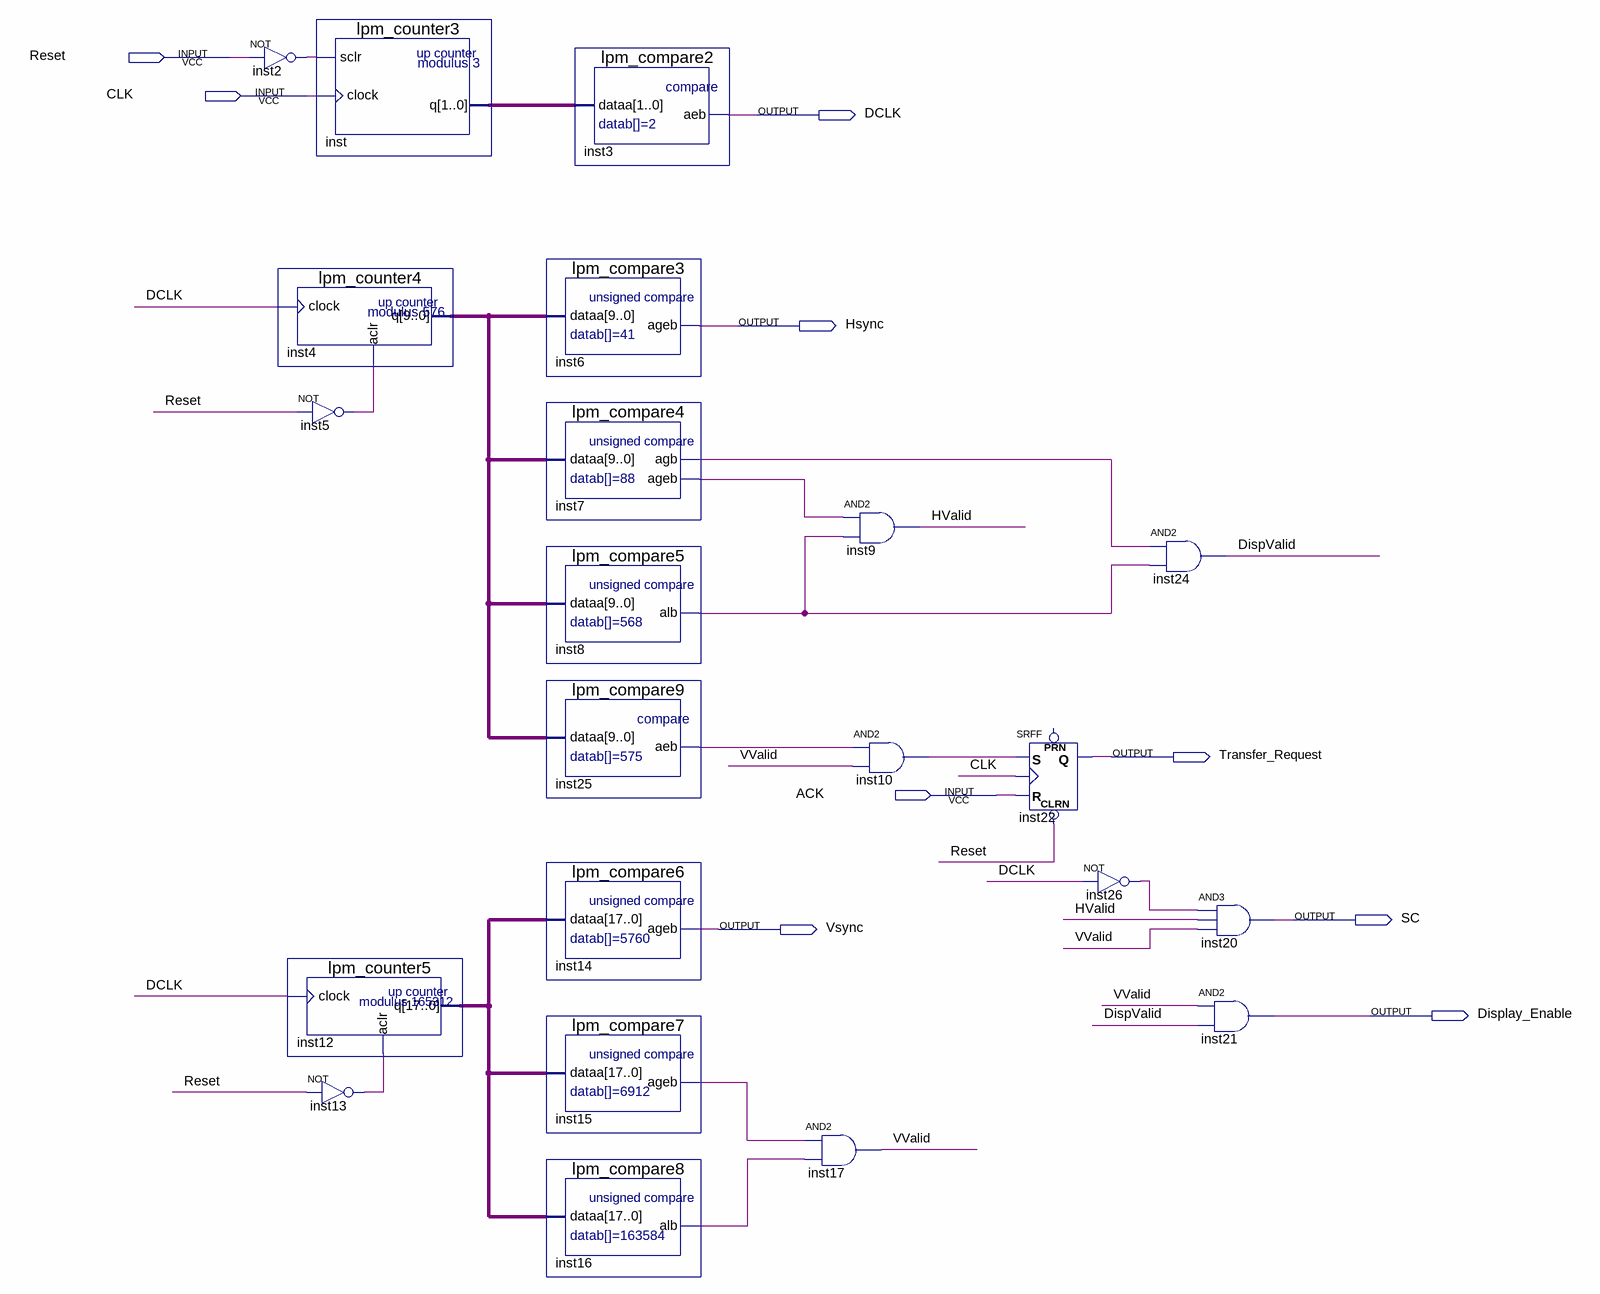
[diagram p0: schematic sheet]
// Quartus schematic LCD.bdf as structural Verilog: 22 symbols, 9 pins
module LCD (
  input  Reset,
  input  CLK,
  input  ACK,
  output DCLK,
  output Hsync,
  output Transfer_Request,
  output SC,
  output Vsync,
  output Display_Enable
);

  wire DispValid, HValid, inst2_out, inst5_out, inst7_agb, inst7_ageb, inst8_alb, inst10_out, inst13_out,
       inst15_ageb, inst16_alb, inst25_aeb, inst26_out, VValid;
  wire [1:0] inst_q;
  wire [9:0] inst4_q;
  wire [17:0] inst12_q;

  not inst2 (inst2_out, Reset);
  lpm_counter4 inst4 (.clock(DCLK), .aclr(inst5_out), .q(inst4_q));
  not inst5 (inst5_out, Reset);
  lpm_counter5 inst12 (.clock(DCLK), .aclr(inst13_out), .q(inst12_q));
  not inst13 (inst13_out, Reset);
  lpm_counter3 inst (.sclr(inst2_out), .clock(CLK), .q(inst_q));
  lpm_compare2 inst3 (.dataa(inst_q), .aeb(DCLK));
  lpm_compare3 inst6 (.dataa(inst4_q), .ageb(Hsync));
  lpm_compare4 inst7 (.dataa(inst4_q), .agb(inst7_agb), .ageb(inst7_ageb));
  lpm_compare5 inst8 (.dataa(inst4_q), .alb(inst8_alb));
  lpm_compare9 inst25 (.dataa(inst4_q), .aeb(inst25_aeb));
  lpm_compare6 inst14 (.dataa(inst12_q), .ageb(Vsync));
  lpm_compare7 inst15 (.dataa(inst12_q), .ageb(inst15_ageb));
  lpm_compare8 inst16 (.dataa(inst12_q), .alb(inst16_alb));
  and inst9 (HValid, inst7_ageb, inst8_alb);
  and inst17 (VValid, inst15_ageb, inst16_alb);
  and inst10 (inst10_out, inst25_aeb, VValid);
  SRFF inst22 (.CLRN(Reset), .S(inst10_out), .R(ACK), .CLK(CLK), .Q(Transfer_Request));  // open: PRN
  and inst24 (DispValid, inst7_agb, inst8_alb);
  not inst26 (inst26_out, DCLK);
  and inst20 (SC, inst26_out, HValid, VValid);
  and inst21 (Display_Enable, VValid, DispValid);
endmodule
